# Altium schematic sheet MCU_SLAVES.SchDoc
size A4; SheetNumber: 3; SheetTotal: 6
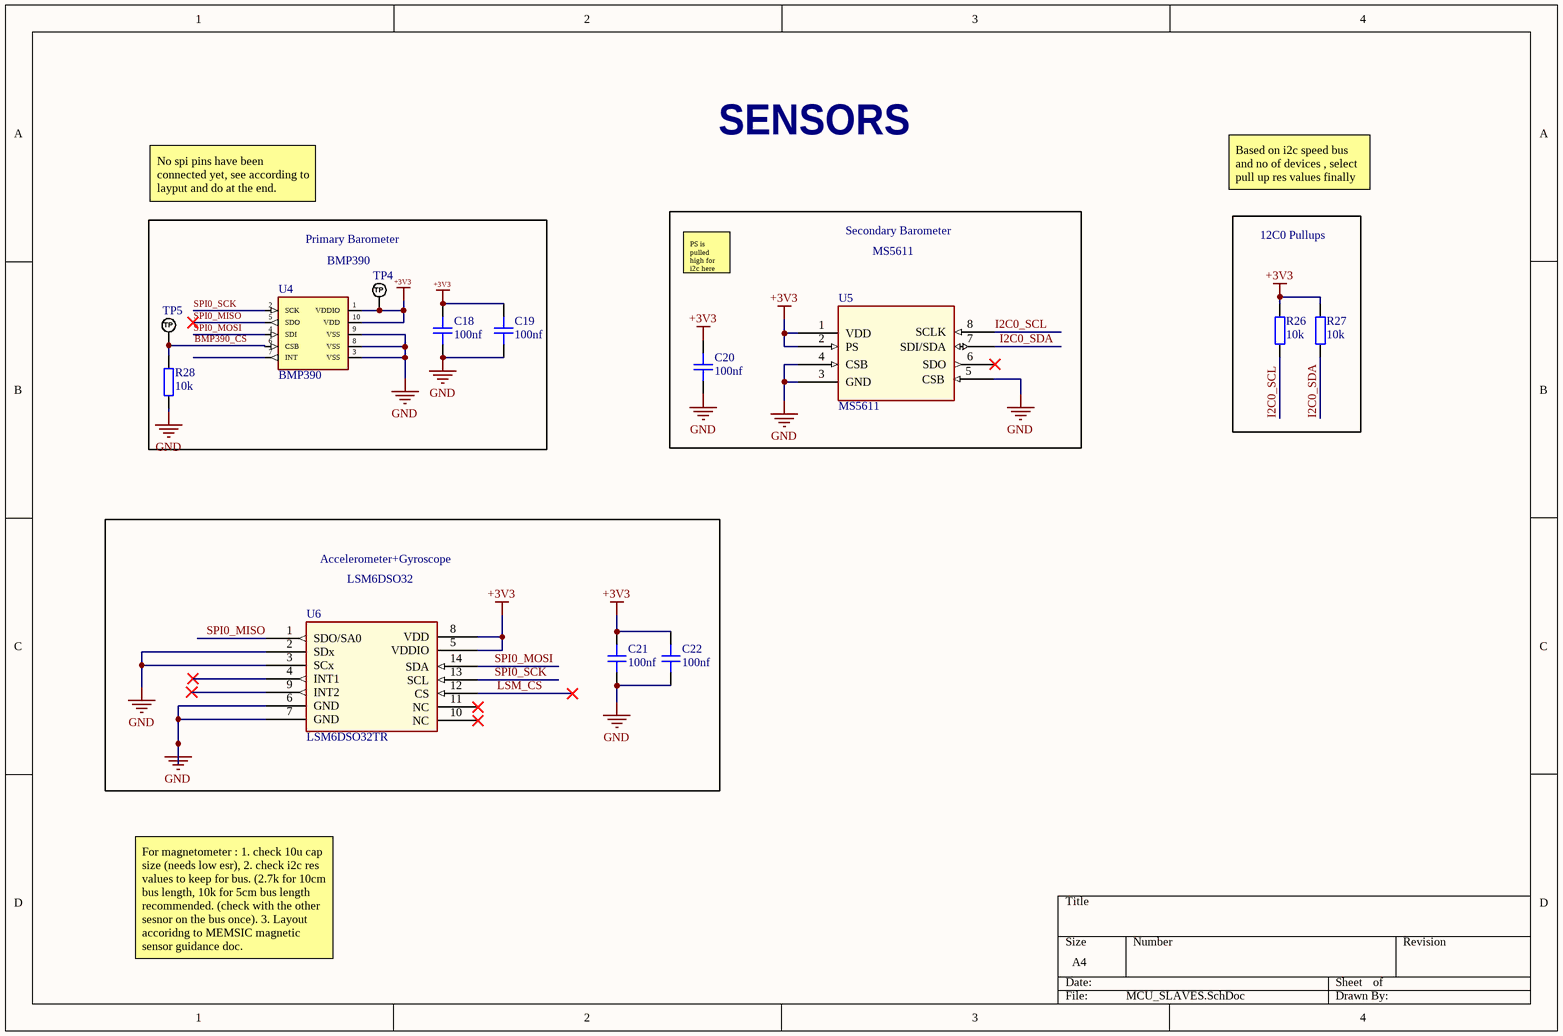
[diagram p0: MCU_SLAVES.SchDoc]

## Parts
C18  100nf  [CAP_0402]
C19  100nf  [CAP_0402]
C20  100nf  [CAP_0402]
C21  100nf  [CAP_0402]
C22  100nf  [CAP_0402]
R26  10k  [RES_0402]
R27  10k  [RES_0402]
R28  10k  [RES_0402]
TP4  TEST_POINT_RND_1MM  [PAD_RND_1MM]  (value not drawn)  (no BOM)
TP5  TEST_POINT_RND_1MM  [PAD_RND_1MM]  (value not drawn)  (no BOM)
U4  BMP390  [BMP390]
U5  MS5611  [MS5611]
U6  LSM6DSO32TR  [LSM6DSO32TR]

## Blocks framed on the sheet
12C0 Pullups: R26 R27

## Nets
+3V3: C18.2 C19.2 C20.2 C21.2 C22.1 R26.2 R27.2 TP4.1(TP) U4.1(VDDIO) U4.10(VDD) U5.1(VDD) U5.2(PS) U6.5(VDDIO) U6.8(VDD)
GND: C18.1 C19.1 C20.1 C21.1 C22.2 R28.1 U4.3(VSS) U4.8(VSS) U4.9(VSS) U5.3(GND) U5.4(CSB) U5.5(CSB) U6.2(SDx) U6.3(SCx) U6.6(GND) U6.7(GND)
BMP390_CS: R28.2 TP5.1(TP) U4.6(CSB)
I2C0_SCL: R26.1 U5.8(SCLK)
I2C0_SDA: R27.1 U5.7(SDI/SDA)
LSM_CS: U6.12(CS)
SPI0_MISO: U4.5(SDO) U6.1(SDO/SA0)
SPI0_MOSI: U4.4(SDI) U6.14(SDA)
SPI0_SCK: U4.2(SCK) U6.13(SCL)

Not connected (* = marked no-connect by the designer): U4 7(INT); U5 6(SDO)*; U6 4(INT1)* 9(INT2)* 10(NC)* 11(NC)*

## Notes on the sheet
- SENSORS
- No spi pins have been connected yet, see according to layput and do at the end.
- Primary Barometer
- Secondary Barometer
- Based on i2c speed bus and no of devices , select pull up res values finally
- BMP390
- PS is pulled high for i2c here
- MS5611
- Accelerometer+Gyroscope
- (near U6) LSM6DSO32
- For magnetometer : 1. check 10u cap size (needs low esr), 2. check i2c res values to keep for bus. (2.7k for 10cm bus length, 10k for 5cm bus length recommended. (check with the other sesnor on the bus once). 3. Layout accoridng to MEMSIC magnetic sensor guidance doc.

## Library data of the parts
C18-C22 = CAP_0402: Capacitor SMD 0402; Manufacturer: *; Manufacturer Part Number: *; Distributor Link: *; LCSC: *; Rating: *; Dielectric: *
R26-R28 = RES_0402: Resistor SMD 0402; Manufacturer: *; Manufacturer Part Number: *; Distributor Link: *; LCSC: *
TP4 TP5 = CMP-019-000001-1: Test Point Round 1mm (NO BOM); Design Item ID: TEST_POINT_RND_1MM; Source: Schematic-Lib-PhilsLab.SchLib